# EAGLE design DispenM2 (EAGLE 9.6.2)
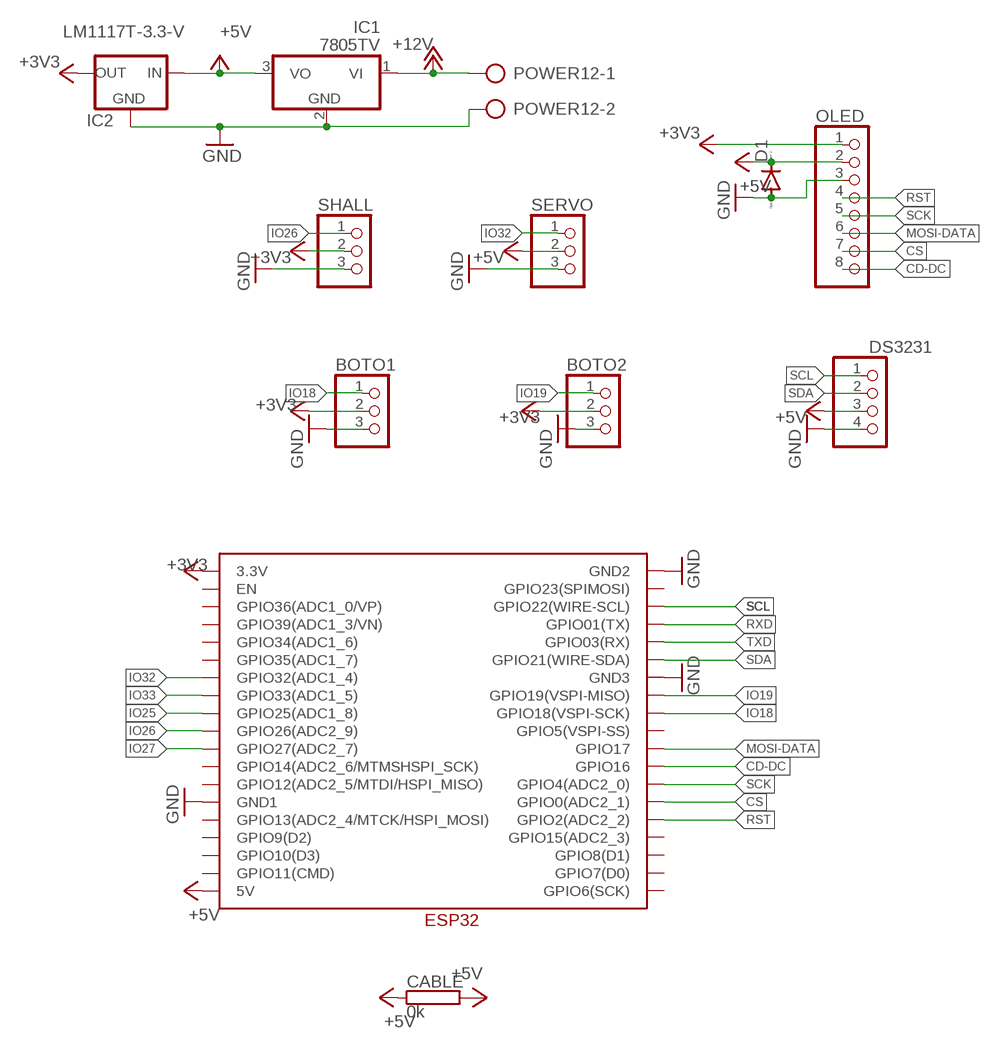
[diagram p0: schematic, sheet 1]

## Parts
BOTO1  PINHD-1X3  [1X03]
BOTO2  PINHD-1X3  [1X03]
CABLE  0k  RCA4100  [CA4100]
D1  DIODE-SOD81  [SOD81]
DS3231  PINHD-1X4  [1X04]
IC1  7805TV  [TO220V]
IC2  LM1117T-3.3-V  [TO220V]
OLED  PINHD-1X8  [1X08]
POWER12  AK500/2  [AK500/2]
SERVO  PINHD-1X3  [1X03]
SHALL  PINHD-1X3  [1X03]
U$1  ESP32WESP32W  [ESP32W]

## Nets
+3V3: BOTO1.2 BOTO2.2 IC2.2(OUT) OLED.1 SHALL.2 U$1.3.3V
+5V: CABLE.1 CABLE.2 D1.C DS3231.3 IC1.3(VO) IC2.3(IN) OLED.2 SERVO.2 U$1.5V
+12V: IC1.1(VI) POWER12.1
CD-DC: OLED.8 U$1.GPIO16
CS: OLED.7 U$1.GPIO0(GPIO0(ADC2_1))
GND: BOTO1.3 BOTO2.3 D1.A DS3231.4 IC1.2(GND) IC2.1(GND) OLED.3 POWER12.2 SERVO.3 SHALL.3 U$1.GND1 U$1.GND2 U$1.GND3
IO18: BOTO1.1 U$1.GPIO18(GPIO18(VSPI-SCK))
IO19: BOTO2.1 U$1.GPIO19(GPIO19(VSPI-MISO))
IO25: U$1.GPIO25(GPIO25(ADC1_8))
IO26: SHALL.1 U$1.GPIO26(GPIO26(ADC2_9))
IO27: U$1.GPIO27(GPIO27(ADC2_7))
IO32: SERVO.1 U$1.GPIO32(GPIO32(ADC1_4))
IO33: U$1.GPIO33(GPIO33(ADC1_5))
MOSI-DATA: OLED.6 U$1.GPIO17
RST: OLED.4 U$1.GPIO2(GPIO2(ADC2_2))
RXD: U$1.TX(GPIO01(TX))
SCK: OLED.5 U$1.GPIO4(GPIO4(ADC2_0))
SCL: DS3231.1 U$1.GPIO22(GPIO22(WIRE-SCL))
SDA: DS3231.2 U$1.GPIO21(GPIO21(WIRE-SDA))
TXD: U$1.RX(GPIO03(RX))
Unconnected: U$1.CLK(GPIO6(SCK)) U$1.CMD(GPIO11(CMD)) U$1.D2(GPIO9(D2)) U$1.D3(GPIO10(D3)) U$1.EN U$1.GPIO5(GPIO5(VSPI-SS)) U$1.GPIO12(GPIO12(ADC2_5/MTDI/HSPI_MISO)) U$1.GPIO13(GPIO13(ADC2_4/MTCK/HSPI_MOSI)) U$1.GPIO14(GPIO14(ADC2_6/MTMSHSPI_SCK)) U$1.GPIO15(GPIO15(ADC2_3)) U$1.GPIO23(GPIO23(SPIMOSI)) U$1.GPIO34(GPIO34(ADC1_6)) U$1.GPIO35(GPIO35(ADC1_7)) U$1.SDI(GPIO8(D1)) U$1.SDO(GPIO7(D0)) U$1.VN(GPIO39(ADC1_3/VN)) U$1.VP(GPIO36(ADC1_0/VP))

## Library data of the parts
BOTO1 BOTO2 SERVO SHALL = pinhead:PINHD-1X3: PIN HEADER
CABLE = resistor-power:R: Power Resitor; OC_FARNELL: unknown; OC_NEWARK: unknown
D1 = diode:DIODE-: DIODE
DS3231 = pinhead:PINHD-1X4: PIN HEADER
IC1 = linear:78*: Positive VOLTAGE REGULATOR Source: http://cache.national.com/ds/LM/LM78L05.pdf http://www.fairchildsemi.com/ds/LM/LM7805.pdf
IC2 = lm1117:LM1117T-*
OLED = pinhead:PINHD-1X8: PIN HEADER
POWER12 = con-ptr500:AK500/2: CONNECTOR; OC_FARNELL: unknown; OC_NEWARK: unknown
U$1 = ESP32-WROOM2:ESP32W

## Board
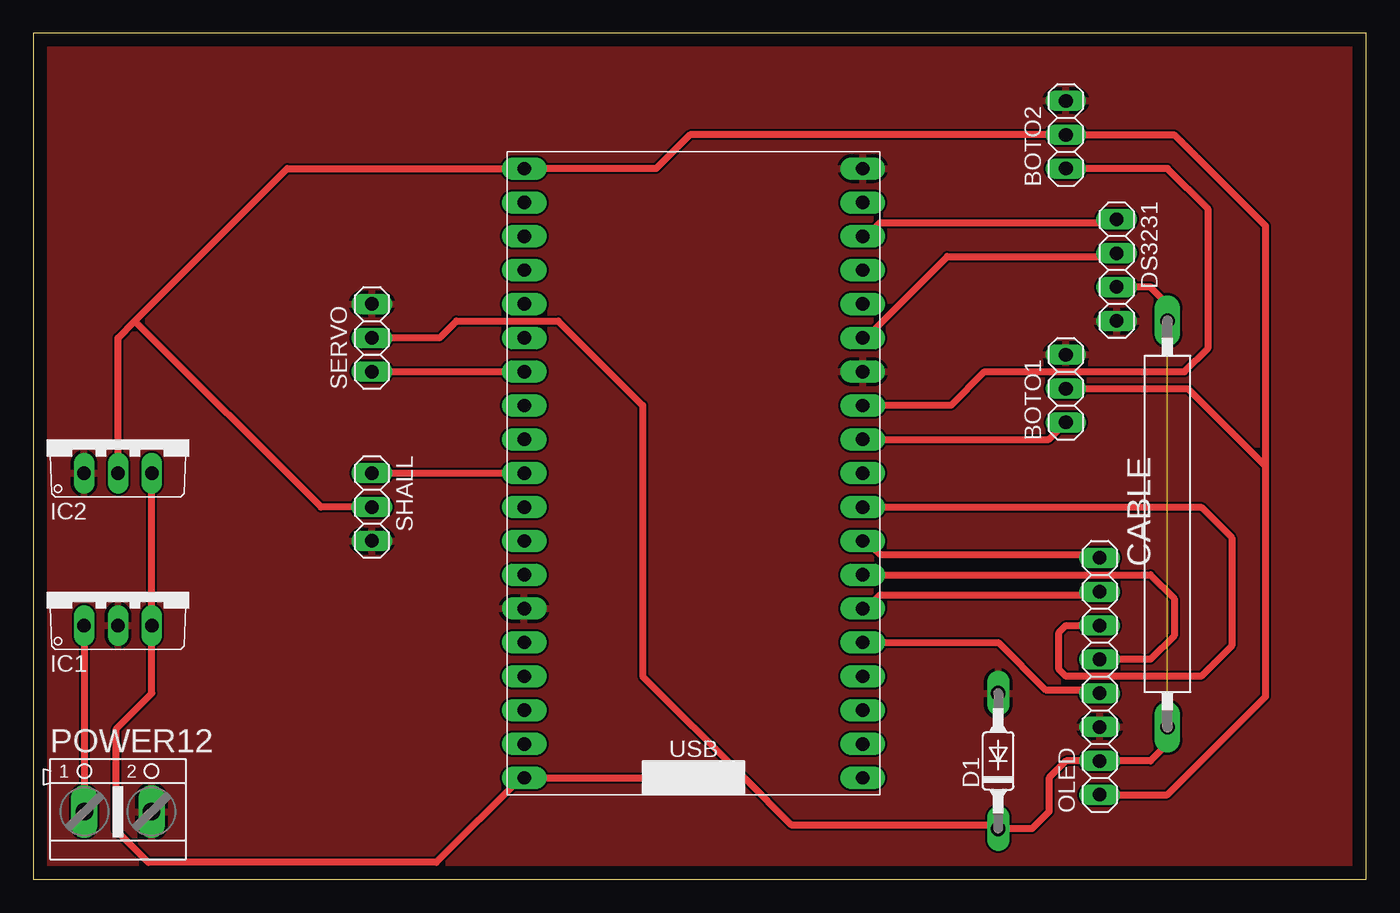
[diagram p1: board, top side]

Size 100 x 63.49 mm. Coordinates in mm from the lower left corner, seen from the top.
Outline: 0,0 100,0 100,63.49 0,63.49 0,0
Copper layers (1*16): Top 0.035mm / dielectric 1.5mm / Bottom 0.035mm
Design rules "default": minimum track width 6mil, minimum drill 0.35mm, track to track 6mil, track to pad 6mil, pad to pad 6mil, via to via 6mil, smd to smd 6mil, copper to edge 40mil, drill to drill 6mil, minimum pad ring 10mil, minimum via ring 8mil, stop-mask expansion 4mil, vias tented up to drill 0mil, thermal gap 10mil

### Footprints (pad centres in the part's own frame; a part is rotated, then mirrored left to right if it is on the bottom)
1X03 = drill 1.016 long: 1 -2.54,0; 2 0,0; 3 2.54,0
CA4100 = drill 1.1 pad 1.93 long: 1 -15.24,0; 2 15.24,0
SOD81 = drill 1.118 long: A 5.08,0; C -5.08,0
1X04 = drill 1.016 long: 1 -3.81,0; 2 -1.27,0; 3 1.27,0; 4 3.81,0
TO220V = drill 1.016 long: 1 -2.54,-2.54; 2 0,-2.54; 3 2.54,-2.54
1X08 = drill 1.016 long: 1 -8.89,0; 2 -6.35,0; 3 -3.81,0; 4 -1.27,0; 5 1.27,0; 6 3.81,0; 7 6.35,0; 8 8.89,0
AK500/2 = drill 1.321 long: 1 -2.515,0; 2 2.515,0
ESP32W = drill 1 pad 1.676 long: 3.3V 1.27,46.99; 5V 1.27,1.27; CLK 26.67,1.27; CMD 1.27,3.81; D2 1.27,8.89; D3 1.27,6.35; EN 1.27,44.45; GND1 1.27,13.97; GND2 26.67,46.99; GND3 26.67,31.75; GPIO0 26.67,13.97; GPIO2 26.67,11.43; GPIO4 26.67,16.51; GPIO5 26.67,24.13; GPIO12 1.27,16.51; GPIO13 1.27,11.43; GPIO14 1.27,19.05; GPIO15 26.67,8.89; GPIO16 26.67,19.05; GPIO17 26.67,21.59; GPIO18 26.67,26.67; GPIO19 26.67,29.21; GPIO21 26.67,34.29; GPIO22 26.67,41.91; GPIO23 26.67,44.45; GPIO25 1.27,26.67; GPIO26 1.27,24.13; GPIO27 1.27,21.59; GPIO32 1.27,31.75; GPIO33 1.27,29.21; GPIO34 1.27,36.83; GPIO35 1.27,34.29; RX 26.67,36.83; SDI 26.67,6.35; SDO 26.67,3.81; TX 26.67,39.37; VN 1.27,39.37; VP 1.27,41.91

### Placement (x,y rotation side)
BOTO1  77.47,36.83 90 top
BOTO2  77.47,55.88 90 top
CABLE  85.09,26.67 90 top
D1  72.39,8.89 90 top
DS3231  81.28,45.72 270 top
IC1  6.35,21.59 0 top
IC2  6.35,33.02 0 top
OLED  80.01,15.24 90 top
POWER12  6.35,5.08 0 top
SERVO  25.4,40.64 90 top
SHALL  25.4,27.94 270 top
U$1  35.56,6.35 0 top

### Tracks (layer width: path | path; a pad name or v marks a point on that pad's centre or on a via)
+3V3
  Top 0.508: 92.46,30.99 92.46,49.02 85.6,55.88 BOTO2.2 49.28,55.88 46.74,53.34 U$1.3.3V 19.05,53.34 7.62,41.91 | IC2.2 6.35,40.64 7.62,41.91 | SHALL.2 21.59,27.94 7.62,41.91 | OLED.1 85.09,6.35 92.46,13.72 92.46,30.99 | 92.46,30.99 86.61,36.83 BOTO1.2
+5V  (1 unrouted)
  Top 0.508: 53.34,7.62 U$1.5V 36.58,7.62 30.23,1.27 8.64,1.27 6.22,3.68 6.22,11.3 8.89,13.97 IC1.3 IC2.3 | 53.34,7.62 56.9,4.06 72.14,4.06 D1.C 74.93,3.81 76.2,5.08 76.2,7.62 77.47,8.89 OLED.2 83.82,8.89 85.09,10.16 CABLE.1 | SERVO.2 30.48,40.64 31.75,41.91 39.37,41.91 45.72,35.56 45.72,15.24 53.34,7.62 | CABLE.2 85.09,43.18 83.82,44.45 DS3231.3
+12V
  Top 0.508: IC1.1 3.83,19.05 POWER12.1
CD-DC
  Top 0.508: OLED.8 79.76,24.38 63.5,24.38 62.48,25.4 U$1.GPIO16
CS
  Top 0.508: OLED.7 79.76,21.34 63.5,21.34 62.48,20.32 U$1.GPIO0
GND
  Top 0.152: 77.72,58.42 BOTO2.3
  Top 0.508: 61.98,38.1 U$1.GND3
  pour Top: 0,-1.27 100.33,-1.27 100.33,63.5 0,63.5
IO18
  Top 0.508: U$1.GPIO18 76.2,33.02 BOTO1.1
IO19
  Top 0.508: BOTO2.1 85.09,53.34 88.14,50.29 88.14,39.88 86.36,38.1 71.37,38.1 68.83,35.56 U$1.GPIO19
IO26
  Top 0.508: SHALL.1 U$1.GPIO26
IO32
  Top 0.508: SERVO.1 U$1.GPIO32
MOSI-DATA
  Top 0.508: OLED.6 77.47,19.05 76.96,18.54 76.96,15.75 77.47,15.24 87.63,15.24 89.92,17.53 89.92,25.65 87.63,27.94 U$1.GPIO17
RST
  Top 0.508: U$1.GPIO2 72.39,17.78 75.95,14.22 79.76,14.22 OLED.4
SCK
  Top 0.508: OLED.5 83.82,16.51 85.6,18.29 85.6,21.08 83.82,22.86 U$1.GPIO4
SCL
  Top 0.508: DS3231.1 81.03,49.28 63.5,49.28 62.48,48.26 U$1.GPIO22
SDA
  Top 0.508: DS3231.2 81.03,46.74 68.58,46.74 62.48,40.64 U$1.GPIO21